# Altium schematic sheet LDO_Pos.SchDoc
size A
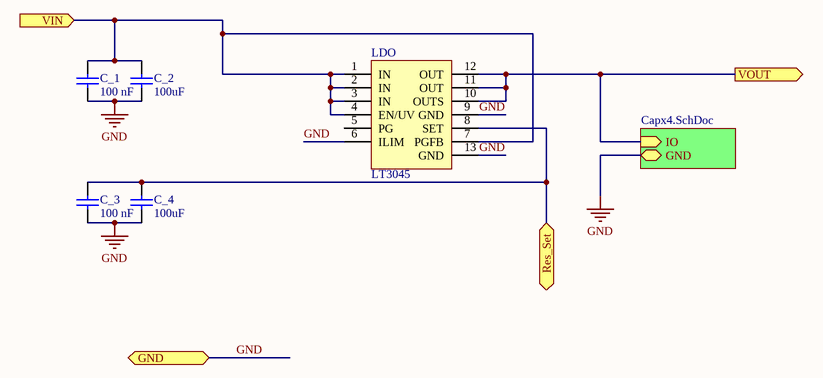
[diagram p0: LDO_Pos.SchDoc]

## Parts
C_1  value 100 nF  [KEMET C0805C104J8RACTU]  (hidden comment: Cap 100nF 0805)
C_2  value 100uF  [Taiyo Yuden JMK316ABJ107ML-T]  (hidden comment: Cap 100uF 1206)
C_3  value 100 nF  [KEMET C0805C104J8RACTU]  (hidden comment: Cap 100nF 0805)
C_4  value 100uF  [Taiyo Yuden JMK316ABJ107ML-T]  (hidden comment: Cap 100uF 1206)
LDO  LT3045  [ADI LT3045IMSE#PBF]

## Sub-sheets
U_Capx4 = Capx4.SchDoc: IO (in), GND (bidir)

## Ports
GND (bidir), Res_Set (bidir), VIN (in), VOUT (out)

## Nets
GND: C_1.2 C_2.2 C_3.2 C_4.2 LDO.6(ILIM) LDO.9(GND) LDO.13(GND) ; port GND, sheet U_Capx4/GND
Res_Set: C_3.1 C_4.1 LDO.8(SET) ; port Res_Set
VIN: C_1.1 C_2.1 LDO.1(IN) LDO.2(IN) LDO.3(IN) LDO.4(EN/UV) LDO.7(PGFB) ; port VIN
VOUT: LDO.10(OUTS) LDO.11(OUT) LDO.12(OUT) ; port VOUT, sheet U_Capx4/IO

Not connected (* = marked no-connect by the designer): LDO 5(PG)

## Library data of the parts
C_1 C_3 = Cap 100nF 0805: CAP CER 0.1UF 10V X7R 0805 / ±10% 10V Ceramic Capacitor X7R 0805 (2012 Metric); Supplier 1: Digi-Key; Supplier Part Number 1: 478-5311-1-ND
C_2 C_4 = Cap 100uF 1206: CAP CER 100UF 6.3V X5R 1206 / ±20% 6.3V Ceramic Capacitor X5R 1206 (3216 Metric); Published: 8-Jun-2000; LatestRevisionDate: 29-May-2009; LatestRevisionNote: IPC-7351 Footprint Added.; PackageReference: C1206; Publisher: Altium Limited; Supplier 1: RSComponents; Supplier Part Number 1: 7661078
LDO = LT3045: IC REG LINEAR 0V 500MA 12MSOP / Linear Voltage Regulator IC Output 500mA 12-MSOP-EP; Supplier 1: Digi-Key; Supplier Part Number 1: LT3045IMSE#PBF-ND; Supplier 2: Digi-Key; Supplier Part Number 2: 505-LT3045IMSE#PBF-ND